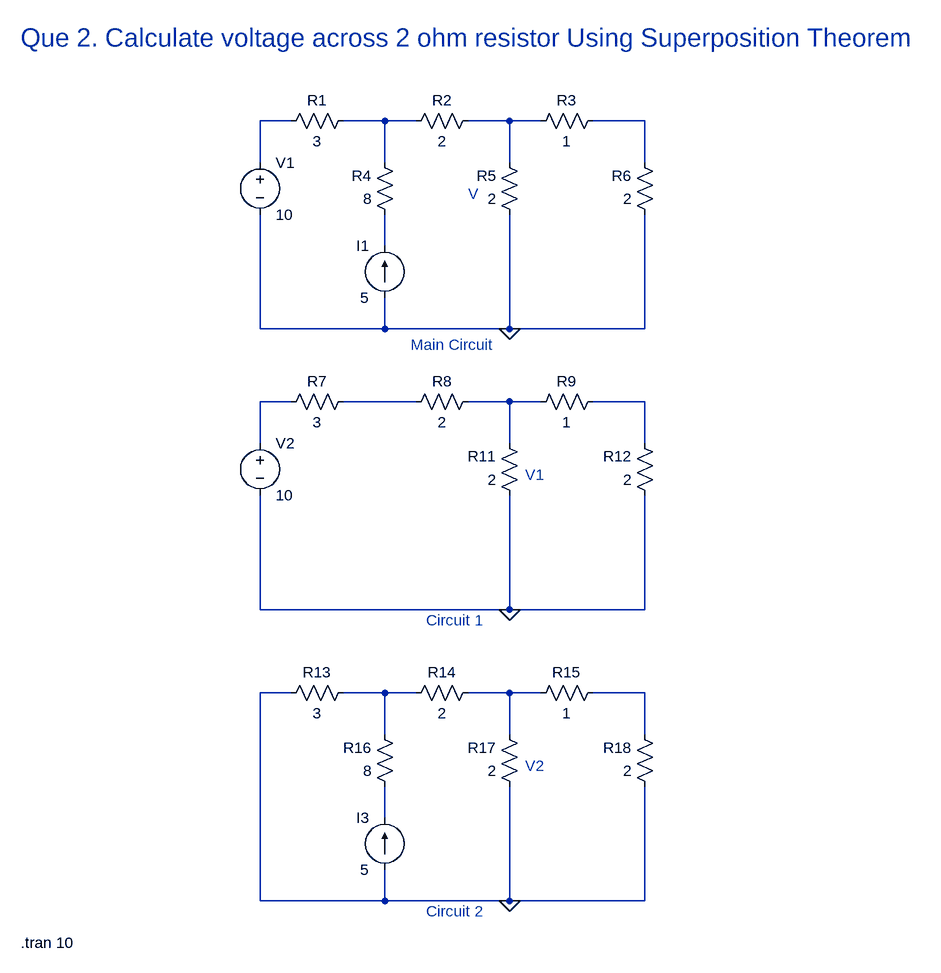
[diagram p0: schematic 2_Dheerendra_23EE019_Superposition_2.asc]
2_Dheerendra_23EE019_Superposition_2.asc, the LTspice schematic file:
Version 4
SHEET 1 880 928
WIRE -5568 -352 -5616 -352
WIRE -5424 -352 -5488 -352
WIRE -5376 -352 -5424 -352
WIRE -5232 -352 -5296 -352
WIRE -5184 -352 -5232 -352
WIRE -5024 -352 -5104 -352
WIRE -5616 -288 -5616 -352
WIRE -5424 -288 -5424 -352
WIRE -5232 -288 -5232 -352
WIRE -5024 -288 -5024 -352
WIRE -5424 -160 -5424 -208
WIRE -5616 -32 -5616 -208
WIRE -5424 -32 -5424 -80
WIRE -5424 -32 -5616 -32
WIRE -5232 -32 -5232 -208
WIRE -5232 -32 -5424 -32
WIRE -5024 -32 -5024 -208
WIRE -5024 -32 -5232 -32
WIRE -5568 80 -5616 80
WIRE -5376 80 -5488 80
WIRE -5232 80 -5296 80
WIRE -5184 80 -5232 80
WIRE -5024 80 -5104 80
WIRE -5616 144 -5616 80
WIRE -5232 144 -5232 80
WIRE -5024 144 -5024 80
WIRE -5616 400 -5616 224
WIRE -5232 400 -5232 224
WIRE -5232 400 -5616 400
WIRE -5024 400 -5024 224
WIRE -5024 400 -5232 400
WIRE -5568 528 -5616 528
WIRE -5424 528 -5488 528
WIRE -5376 528 -5424 528
WIRE -5232 528 -5296 528
WIRE -5184 528 -5232 528
WIRE -5024 528 -5104 528
WIRE -5424 592 -5424 528
WIRE -5232 592 -5232 528
WIRE -5024 592 -5024 528
WIRE -5424 720 -5424 672
WIRE -5616 848 -5616 528
WIRE -5424 848 -5424 800
WIRE -5424 848 -5616 848
WIRE -5232 848 -5232 672
WIRE -5232 848 -5424 848
WIRE -5024 848 -5024 672
WIRE -5024 848 -5232 848
FLAG -5232 -32 0
FLAG -5232 400 0
FLAG -5232 848 0
SYMBOL res -5472 -368 R90
WINDOW 0 0 56 VBottom 2
WINDOW 3 32 56 VTop 2
SYMATTR InstName R1
SYMATTR Value 3
SYMBOL res -5280 -368 R90
WINDOW 0 0 56 VBottom 2
WINDOW 3 32 56 VTop 2
SYMATTR InstName R2
SYMATTR Value 2
SYMBOL res -5088 -368 R90
WINDOW 0 0 56 VBottom 2
WINDOW 3 32 56 VTop 2
SYMATTR InstName R3
SYMATTR Value 1
SYMBOL res -5408 -192 R180
WINDOW 0 36 76 Left 2
WINDOW 3 36 40 Left 2
SYMATTR InstName R4
SYMATTR Value 8
SYMBOL res -5216 -192 R180
WINDOW 0 36 76 Left 2
WINDOW 3 36 40 Left 2
SYMATTR InstName R5
SYMATTR Value 2
SYMBOL res -5008 -192 R180
WINDOW 0 36 76 Left 2
WINDOW 3 36 40 Left 2
SYMATTR InstName R6
SYMATTR Value 2
SYMBOL current -5424 -80 R180
WINDOW 0 24 80 Left 2
WINDOW 3 24 0 Left 2
WINDOW 123 0 0 Left 0
WINDOW 39 0 0 Left 0
SYMATTR InstName I1
SYMATTR Value 5
SYMBOL voltage -5616 -304 R0
WINDOW 123 0 0 Left 0
WINDOW 39 0 0 Left 0
SYMATTR InstName V1
SYMATTR Value 10
SYMBOL res -5472 64 R90
WINDOW 0 0 56 VBottom 2
WINDOW 3 32 56 VTop 2
SYMATTR InstName R7
SYMATTR Value 3
SYMBOL res -5280 64 R90
WINDOW 0 0 56 VBottom 2
WINDOW 3 32 56 VTop 2
SYMATTR InstName R8
SYMATTR Value 2
SYMBOL res -5088 64 R90
WINDOW 0 0 56 VBottom 2
WINDOW 3 32 56 VTop 2
SYMATTR InstName R9
SYMATTR Value 1
SYMBOL res -5216 240 R180
WINDOW 0 36 76 Left 2
WINDOW 3 36 40 Left 2
SYMATTR InstName R11
SYMATTR Value 2
SYMBOL res -5008 240 R180
WINDOW 0 36 76 Left 2
WINDOW 3 36 40 Left 2
SYMATTR InstName R12
SYMATTR Value 2
SYMBOL voltage -5616 128 R0
WINDOW 123 0 0 Left 0
WINDOW 39 0 0 Left 0
SYMATTR InstName V2
SYMATTR Value 10
SYMBOL res -5472 512 R90
WINDOW 0 0 56 VBottom 2
WINDOW 3 32 56 VTop 2
SYMATTR InstName R13
SYMATTR Value 3
SYMBOL res -5280 512 R90
WINDOW 0 0 56 VBottom 2
WINDOW 3 32 56 VTop 2
SYMATTR InstName R14
SYMATTR Value 2
SYMBOL res -5088 512 R90
WINDOW 0 0 56 VBottom 2
WINDOW 3 32 56 VTop 2
SYMATTR InstName R15
SYMATTR Value 1
SYMBOL res -5408 688 R180
WINDOW 0 36 76 Left 2
WINDOW 3 36 40 Left 2
SYMATTR InstName R16
SYMATTR Value 8
SYMBOL res -5216 688 R180
WINDOW 0 36 76 Left 2
WINDOW 3 36 40 Left 2
SYMATTR InstName R17
SYMATTR Value 2
SYMBOL res -5008 688 R180
WINDOW 0 36 76 Left 2
WINDOW 3 36 40 Left 2
SYMATTR InstName R18
SYMATTR Value 2
SYMBOL current -5424 800 R180
WINDOW 0 24 80 Left 2
WINDOW 3 24 0 Left 2
WINDOW 123 0 0 Left 0
WINDOW 39 0 0 Left 0
SYMATTR InstName I3
SYMATTR Value 5
TEXT -5984 -480 Left 4 ;Que 2. Calculate voltage across 2 ohm resistor Using Superposition Theorem
TEXT -5984 912 Left 2 !.tran 10
TEXT -5384 -8 Left 2 ;Main Circuit
TEXT -5360 416 Left 2 ;Circuit 1
TEXT -5360 864 Left 2 ;Circuit 2
TEXT -5296 -240 Left 2 ;V
TEXT -5208 192 Left 2 ;V1
TEXT -5208 640 Left 2 ;V2

The netlist it stands for:
* 2_Dheerendra_23EE019_Superposition_2.asc
R1 N002 N001 3
R2 N003 N002 2
R3 N004 N003 1
R4 N005 N002 8
R5 0 N003 2
R6 0 N004 2
I1 0 N005 5
V1 N001 0 10
R7 N007 N006 3
R8 N008 N007 2
R9 N009 N008 1
R11 0 N008 2
R12 0 N009 2
V2 N006 0 10
R13 N010 0 3
R14 N011 N010 2
R15 N012 N011 1
R16 N013 N010 8
R17 0 N011 2
R18 0 N012 2
I3 0 N013 5
* Que 2. Calculate voltage across 2 ohm resistor Using Superposition Theorem
.tran 10
* Main Circuit
* Circuit 1
* Circuit 2
* V
* V1
* V2
.backanno
.end